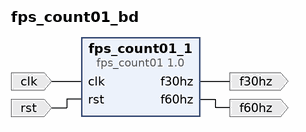
[diagram p0: block diagram of the top level]
# Vivado block design fps_count01_bd, xczu7ev-fbvb900-2-i-EVAL, Vivado 2016.4
create_bd_design fps_count01_bd

create_bd_port -dir I -type clk clk
create_bd_port -dir O -type data f30hz
create_bd_port -dir O -type data f60hz
create_bd_port -dir I -type rst rst

create_bd_cell -type ip -vlnv User_Company:SysGen:fps_count01:1.0 fps_count01_1

# ---- connections ----

connect_bd_net [get_bd_ports clk] [get_bd_pins fps_count01_1/clk]
connect_bd_net [get_bd_pins fps_count01_1/f30hz] [get_bd_ports f30hz]
connect_bd_net [get_bd_pins fps_count01_1/f60hz] [get_bd_ports f60hz]
connect_bd_net [get_bd_ports rst] [get_bd_pins fps_count01_1/rst]

validate_bd_design
save_bd_design
